# EAGLE design attiny_minimal (EAGLE 6.1)
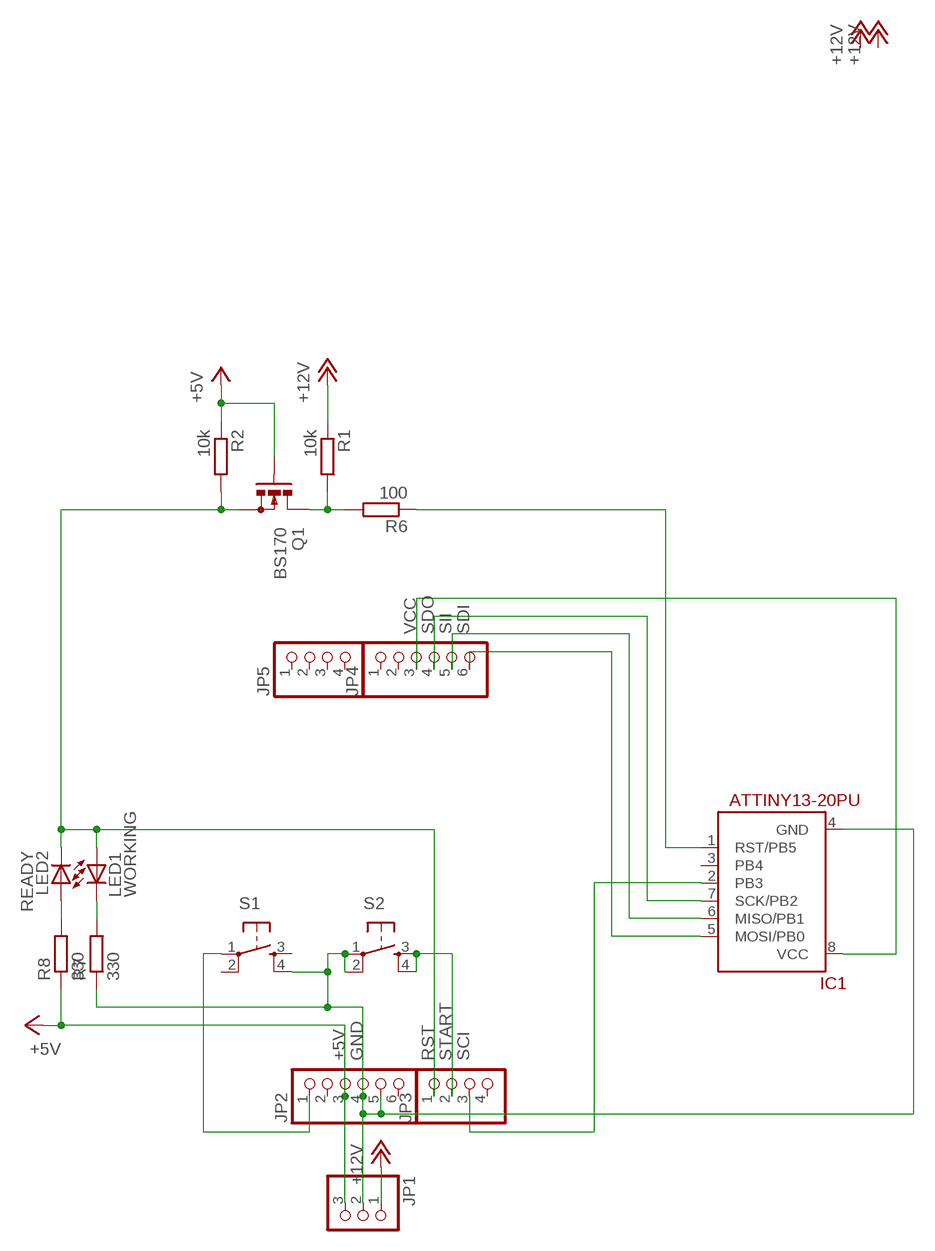
[diagram p0: schematic, sheet 1]

## Parts
IC1  ATTINY13-20PU  [DIL08]
JP1  PINHD-1X3/90  [1X03/90]
JP2  PINHD-1X6  [1X06]
JP3  PINHD-1X4  [1X04]
JP4  PINHD-1X6  [1X06]
JP5  PINHD-1X4  [1X04]
LED1  WORKING  LED3MM  [LED3MM]
LED2  READY  LED3MM  [LED3MM]
Q1  BS170  [SOT54E]
R1  10k  R-EU_0207/2V  [0207/2V]
R2  10k  R-EU_0204/7  [0204/7]
R6  100  R-EU_0204/7  [0204/7]
R7  330  R-EU_0207/2V  [0207/2V]
R8  330  R-EU_0207/2V  [0207/2V]
S1  TAC_SWITCHPTH  [TACTILE-PTH]
S2  TAC_SWITCHPTH  [TACTILE-PTH]

## Nets
+5V: JP1.3 JP2.3 Q1.G R2.1 R8.1
+12V: JP1.1 R1.1
GND: IC1.4(GND) JP1.2 JP2.4 JP2.5 R7.1 S1.4 S2.1 S2.2
N$1: JP2.1 S1.1
N$2: LED1.K(C) R7.2
N$3: LED2.A R8.2
N$13: Q1.D R1.2 R6.2
N$16: IC1.1(RST/PB5) R6.1
RST: JP3.1 LED1.A LED2.K(C) Q1.S R2.2
SCI: IC1.2(PB3) JP3.3
SDI: IC1.5(MOSI/PB0) JP4.6
SDO: IC1.7(SCK/PB2) JP4.4
SII: IC1.6(MISO/PB1) JP4.5
START: JP3.2 S2.3 S2.4
VCC: IC1.8(VCC) JP4.3
Unconnected: IC1.3(PB4) JP2.2 JP2.6 JP3.4 JP4.1 JP4.2 JP5.1 JP5.2 JP5.3 JP5.4 S1.2 S1.3

## Library data of the parts
IC1 = attiny13:ATTINY13-20*
JP1 = pinhead:PINHD-1X3: PIN HEADER
JP2 JP4 = pinhead:PINHD-1X6: PIN HEADER
JP3 JP5 = pinhead:PINHD-1X4: PIN HEADER
LED1 LED2 = led:LED: LED OSRAM: - CHIPLED LG R971, LG N971, LY N971, LG Q971, LY Q971, LO R971, LY R971 LH N974, LH R974 LS Q976, LO Q976, LY Q976 LO Q996 - Hyper CHIPLED LW Q18S LB Q993, LB Q99A, LB R99A - SideLED LS A670, LO A670, LY A670, LG A670, LP A670 LB A673, LV A673, LT A673, LW A673 LH A674 LY A675 LS A676, LA A676, LO A676, LY A676, LW A676 LS A679, LY A679, LG A679 - Hyper Micro SIDELED® LS Y876, LA Y876, LO Y876, LY Y876 LT Y87S - SmartLED LW L88C, LW L88S LB L89C, LB L89S, LG L890 LS L89K, LO L89K, LY L89K LS L896, LA L896, LO L896, LY L896 - TOPLED LS T670, LO T670, LY T670, LG T670, LP T670 LSG T670, LSP T670, LSY T670, LOP T670, LYG T670 LG T671, LOG T671, LSG T671 LB T673, LV T673, LT T673, LW T673 LH T674 LS T676, LA T676, LO T676, LY T676, LB T676, LH T676, LSB T676, LW T676 LB T67C, LV T67C, LT T67C, LS T67K, LO T67K, LY T67K, LW E67C LS E67B, LA E67B, LO E67B, LY E67B, LB E67C, LV E67C, LT E67C LW T67C LS T679, LY T679, LG T679 LS T770, LO T770, LY T770, LG T770, LP T770 LB T773, LV T773, LT T773, LW T773 LH T774 LS E675, LA E675, LY E675, LS T675 LS T776, LA T776, LO T776, LY T776, LB T776 LHGB T686 LT T68C, LB T68C - Hyper Mini TOPLED® LB M676 - Mini TOPLED Santana® LG M470 LS M47K, LO M47K, LY M47K Source: http://www.osram.convergy.de LUXEON: - LUMILED® LXK2-PW12-R00, LXK2-PW12-S00, LXK2-PW14-U00, LXK2-PW14-V00 LXK2-PM12-R00, LXK2-PM12-S00, LXK2-PM14-U00 LXK2-PE12-Q00, LXK2-PE12-R00, LXK2-PE12-S00, LXK2-PE14-T00, LXK2-PE14-U00 LXK2-PB12-K00, LXK2-PB12-L00, LXK2-PB12-M00, LXK2-PB14-N00, LXK2-PB14-P00, LXK2-PB14-Q00 LXK2-PR12-L00, LXK2-PR12-M00, LXK2-PR14-Q00, LXK2-PR14-R00 LXK2-PD12-Q00, LXK2-PD12-R00, LXK2-PD12-S00 LXK2-PH12-R00, LXK2-PH12-S00 LXK2-PL12-P00, LXK2-PL12-Q00, LXK2-PL12-R00 Source: www.luxeon.com KINGBRIGHT: KA-3528ASYC Source: www.kingbright.com
Q1 = transistor-small-signal:BS170: N-CHANNEL MOS FET
R1 R2 R6-R8 = rcl:R-EU_: RESISTOR, European symbol
S1 S2 = SparkFun:TAC_SWITCH: Momentary Switch Button commonly used for reset or general input. Spark Fun Electronics SKU : COM-00097

## Board
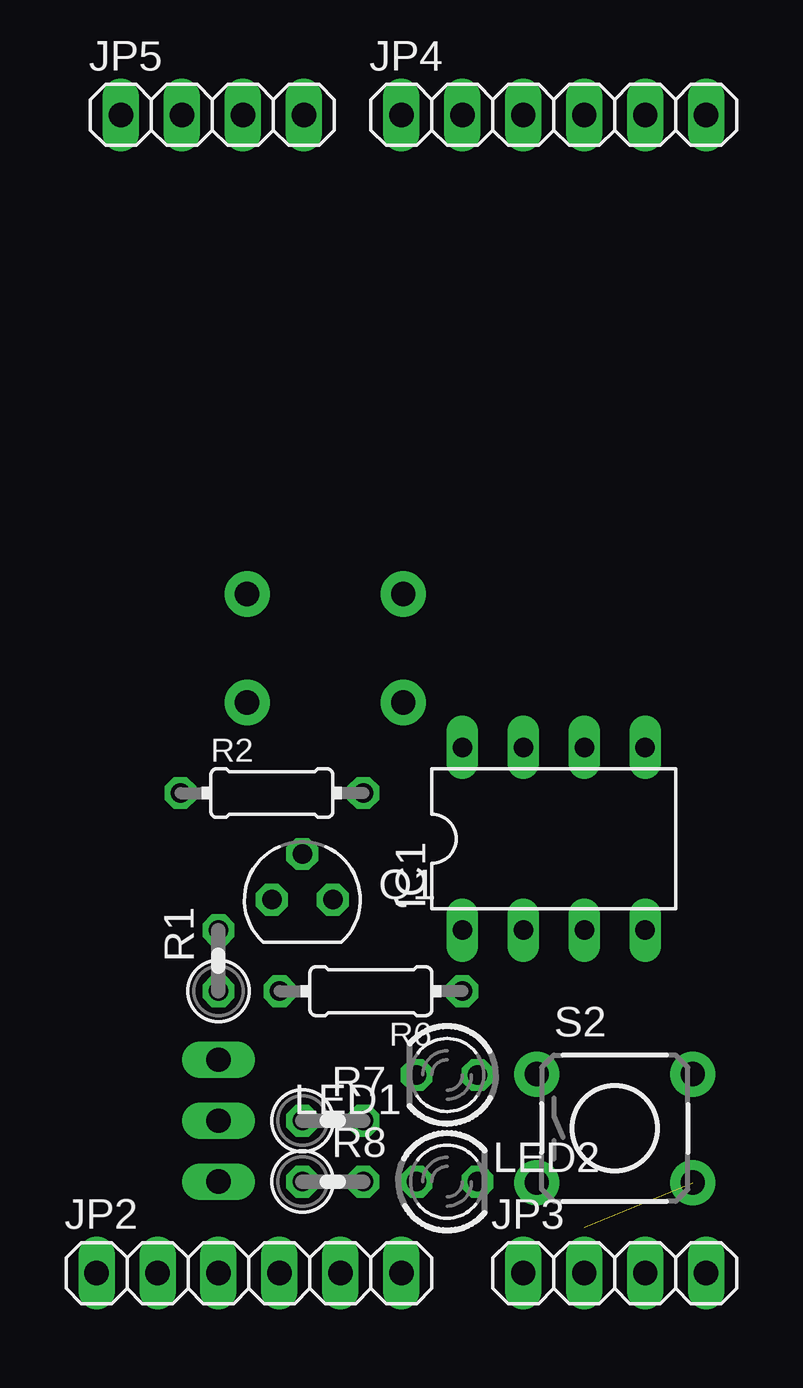
[diagram p1: board, top side]
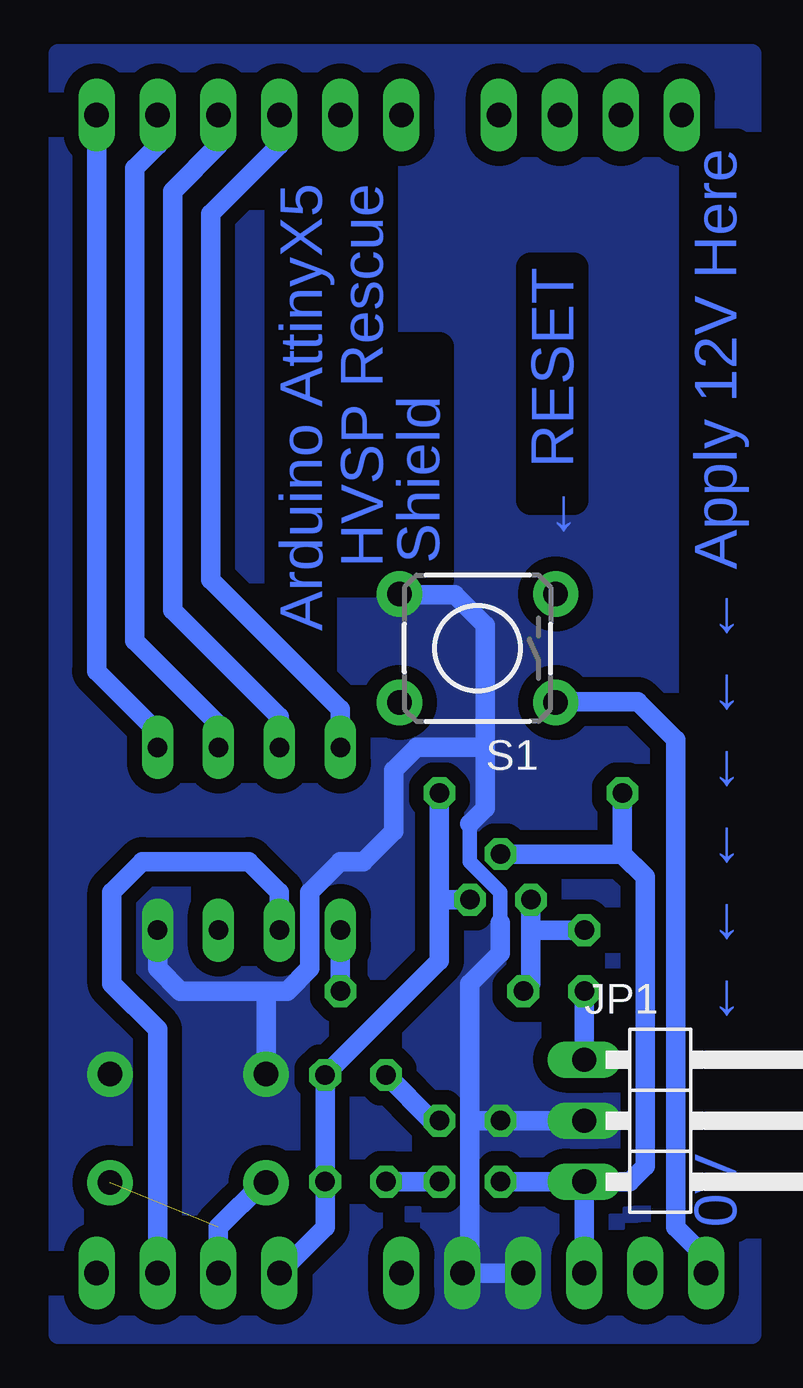
[diagram p2: board, bottom side, seen from below]

No outline drawn. Coordinates in mm, seen from the top.
Copper layers (1*16): Top 0.035mm / dielectric 1.5mm / Bottom 0.035mm
Design rules: minimum track width 10mil, minimum drill 24mil, track to track 8mil, track to pad 8mil, pad to pad 8mil, via to via 8mil, smd to smd 8mil, copper to edge 40mil, drill to drill 8mil, minimum pad ring 10mil, minimum via ring 8mil, stop-mask expansion 4mil, vias tented up to drill 0mil, thermal gap 10mil

### Footprints (pad centres in the part's own frame; a part is rotated, then mirrored left to right if it is on the bottom)
DIL08 = drill 0.813 long: 1 -3.81,-3.81; 2 -1.27,-3.81; 3 1.27,-3.81; 4 3.81,-3.81; 5 3.81,3.81; 6 1.27,3.81; 7 -1.27,3.81; 8 -3.81,3.81
1X03/90 = drill 1.016 long: 1 -2.54,-3.81; 2 0,-3.81; 3 2.54,-3.81
1X06 = drill 1.016 long: 1 -6.35,0; 2 -3.81,0; 3 -1.27,0; 4 1.27,0; 5 3.81,0; 6 6.35,0
1X04 = drill 1.016 long: 1 -3.81,0; 2 -1.27,0; 3 1.27,0; 4 3.81,0
LED3MM = drill 0.813 octagon: A -1.27,0; K 1.27,0
SOT54E = drill 0.813 octagon: D -1.27,0; G 0,1.905; S 1.27,0
0207/2V = drill 0.813 octagon: 1 -1.27,0; 2 1.27,0
0204/7 = drill 0.813 octagon: 1 -3.81,0; 2 3.81,0
TACTILE-PTH = drill 1.016 pad 1.88: 1 -3.251,2.261; 2 3.251,2.261; 3 -3.251,-2.261; 4 3.251,-2.261

### Placement (x,y rotation side)
IC1  20.95,20.64 0 top
JP1  3.17,8.89 270 bottom
JP2  8.26,2.54 0 top
JP3  23.5,2.54 0 top
JP4  20.95,50.8 0 top
JP5  6.73,50.8 0 top
LED1  16.51,10.79 180 top
LED2  16.51,6.35 0 top
Q1  10.48,18.1 0 top
R1  6.99,15.56 90 top
R2  9.21,22.54 0 top
R6  13.34,14.29 180 top
R7  11.75,8.89 0 top
R8  11.75,6.35 0 top
S1  11.43,28.57 180 bottom
S2  23.5,8.57 0 top

### Tracks (layer width: path | path; a pad name or v marks a point on that pad's centre or on a via)
+5V
  Bottom 0.813: JP2.3 JP1.3 | JP1.3 5.08,6.35 4.45,6.99 4.45,19.05 5.4,20 | 5.4,20 R2.1 | Q1.G 5.4,20 | R8.1 JP1.3
+12V
  Bottom 0.813: R1.1 JP1.1
GND
  Bottom 0.61: 10.48,17.14 10.48,18.41 11.75,19.68 11.75,21.27
  Bottom 0.813: JP2.4 11.75,2.54 | 11.75,2.54 JP2.5 | IC1.4 24.77,15.24 23.81,14.29 20.32,14.29 | JP1.2 R7.1 11.75,8.89 | 11.75,21.27 11.11,21.91 11.11,24.45 | 11.11,24.45 13.97,24.45 14.92,23.5 14.92,20.95 16.19,19.68 17.14,19.68 18.41,18.41 18.41,15.24 19.37,14.29 20.32,14.29 | 20.24,11.04 20.24,14.21 20.32,14.29 | 11.75,8.89 11.75,2.54 | 11.75,8.89 11.75,14.61 10.48,15.88 10.48,17.14 | 11.11,24.45 11.11,29.53 12.38,30.8 14.61,30.8 14.64,30.84 S1.4
  pour Bottom (isolate 0.61, no thermals): 0.32,0 28.89,0 28.89,53.34 0,53.34 0,0
N$1
  Bottom 0.813: JP2.1 1.91,3.17 3.17,4.45 3.17,24.77 4.76,26.35 8.14,26.35 S1.1
N$2
  Bottom 0.813: R7.2 13.34,8.89 LED1.K
N$3
  Bottom 0.813: R8.2 LED2.A
N$13
  Bottom 0.813: Q1.D 9.21,16.83 | 9.21,16.83 9.21,14.61 R6.2 | R1.2 9.21,16.83
N$16
  Bottom 0.813: R6.1 IC1.1
RST
  Bottom 0.813: JP3.1 17.78,4.45 LED2.K LED1.A 13.02,15.56 13.02,18.1 | R2.2 13.02,18.1 | Q1.S 13.02,18.1
SCI
  Bottom 0.813: JP3.3 24.77,12.7 26.67,14.61 26.67,18.41 25.4,19.68 20.95,19.68 19.68,18.41 IC1.2
SDI
  Bottom 0.813: JP4.6 27.3,27.62 24.77,25.08 IC1.5
SDO
  Bottom 0.813: IC1.7 19.68,25.72 24.13,30.16 24.13,47.62 22.23,49.53 JP4.4
SII
  Bottom 0.813: IC1.6 22.23,25.4 25.72,28.89 25.72,48.58 24.77,49.53 JP4.5
START  (1 unrouted)
  Bottom 0.813: S2.3 20.36,6.31 22.23,4.45 JP3.2
VCC
  Bottom 0.813: IC1.8 17.14,26.04 22.54,31.43 22.54,46.67 19.68,49.53 JP4.3

### Text on the board
Bottom: HVSP Rescue | Arduino AttinyX5 | ← RESET | Shield | ↑ ← ← ← ← ← ← Apply 12V Here | 0V ↑